# Altium schematic sheet PAGE1 - CONTENTS.SchDoc
size A3; DocumentNumber: 1; SheetNumber: 1; SheetTotal: 2
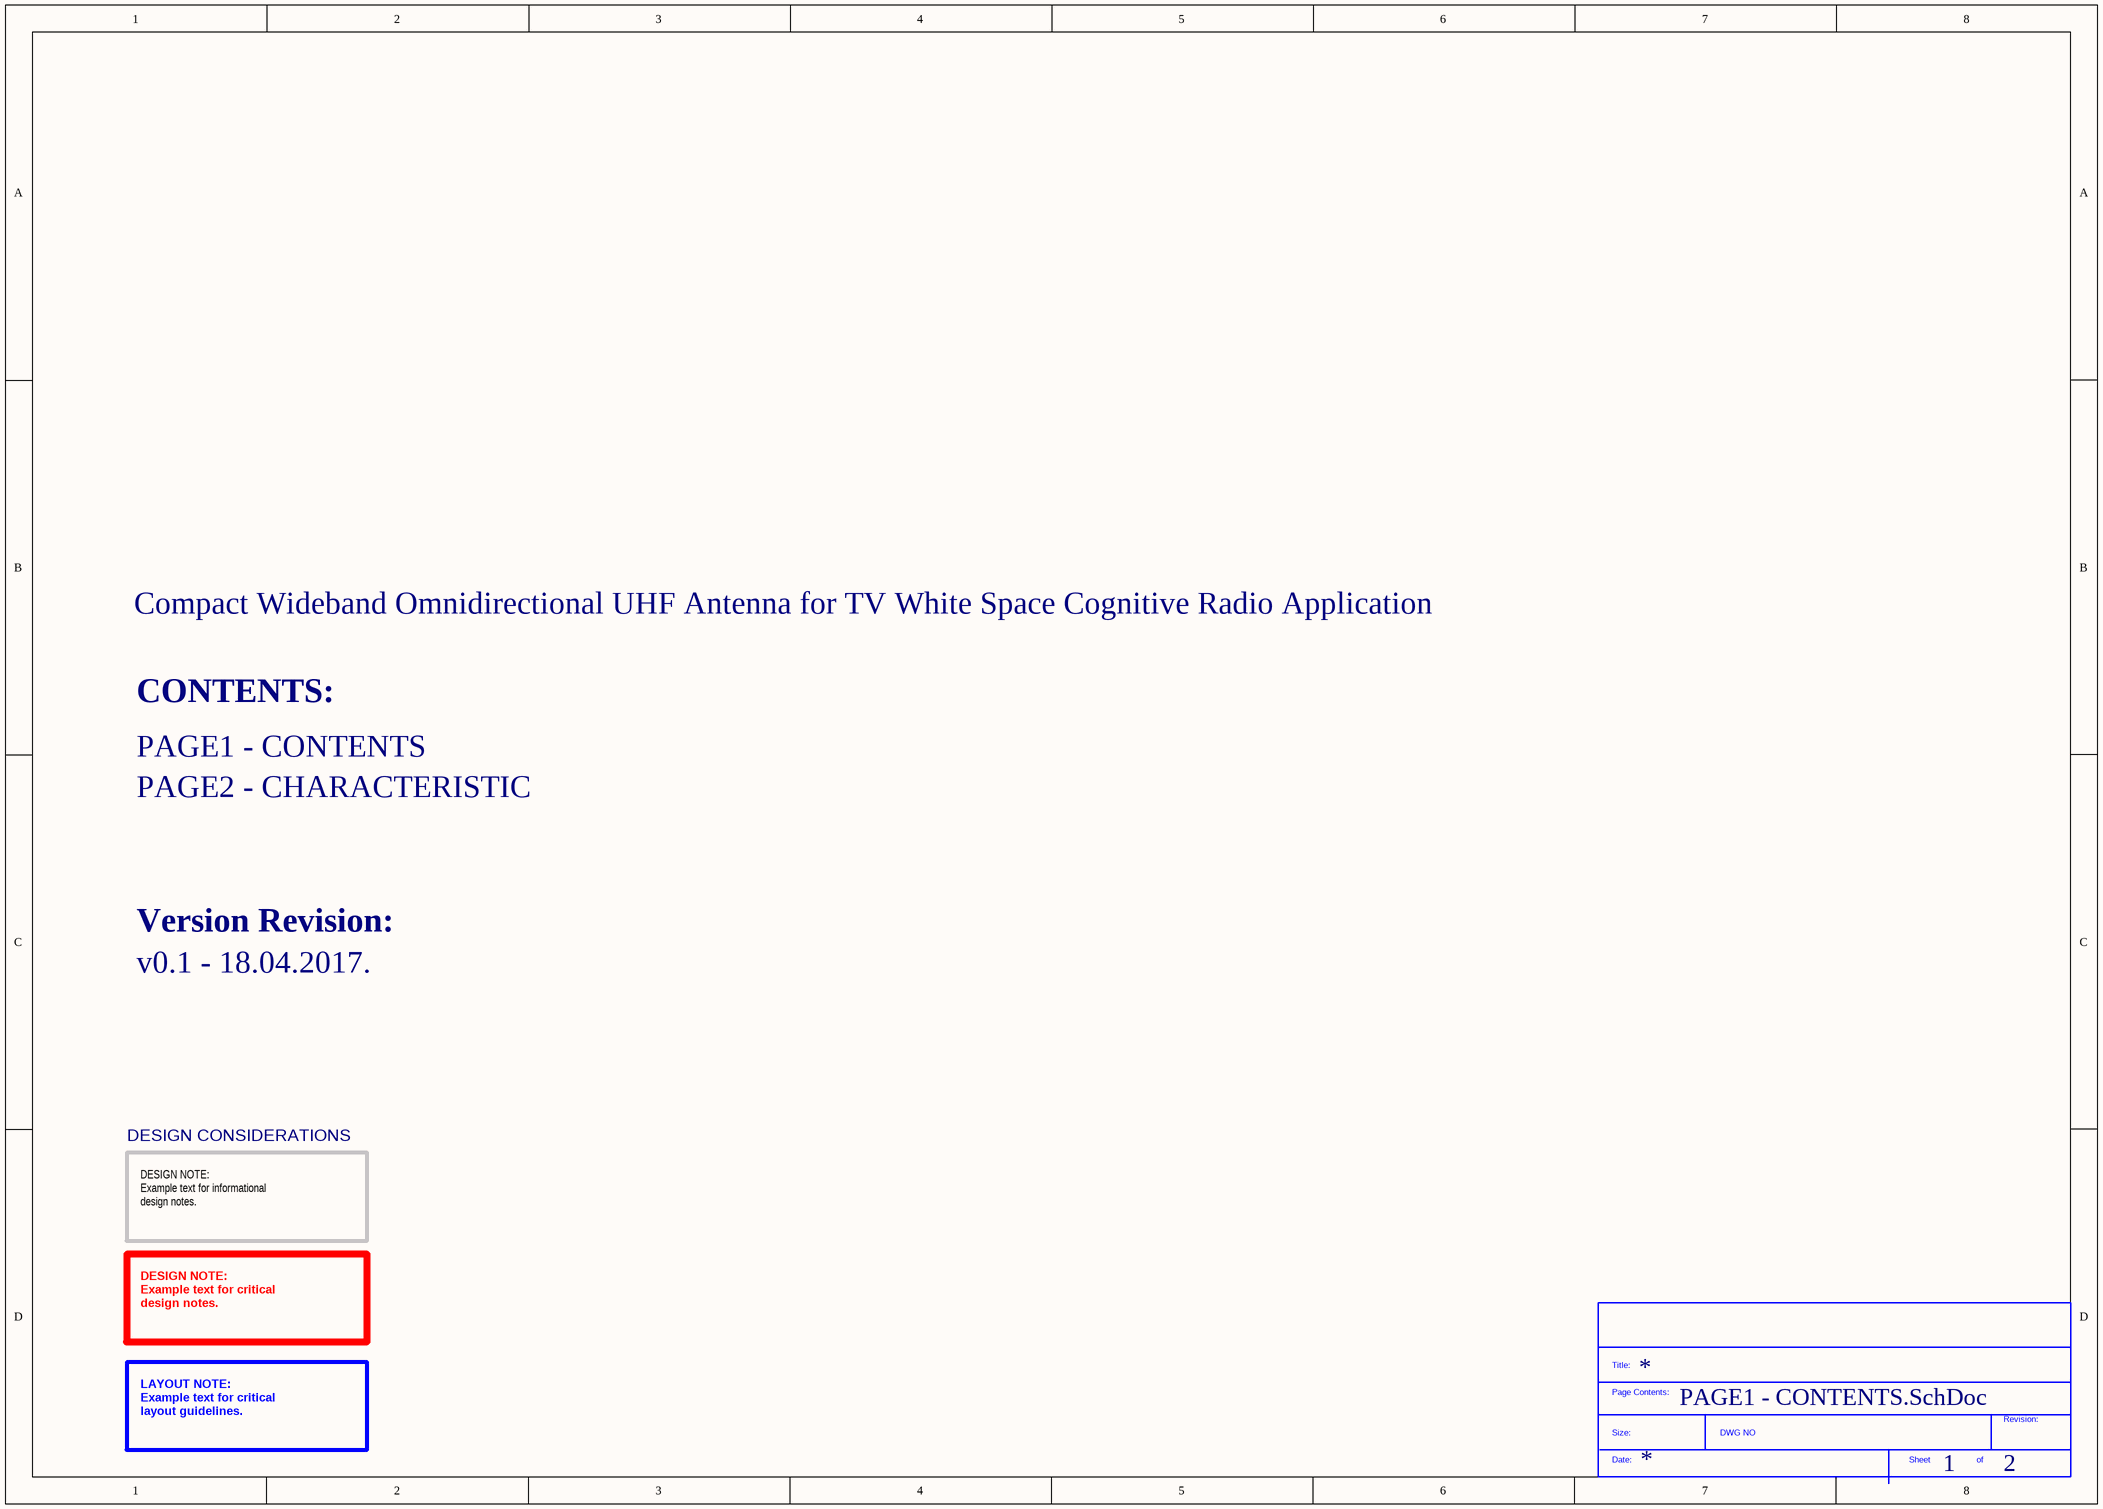
[diagram p0: PAGE1 - CONTENTS.SchDoc]

## Parts
*?  SDTitleBlock  (value not drawn)  (graphical)

## Notes on the sheet
- Compact Wideband Omnidirectional UHF Antenna for TV White Space Cognitive Radio Application
- CONTENTS:
- PAGE1 - CONTENTS
- PAGE2 - CHARACTERISTIC
- Version Revision:
- v0.1 - 18.04.2017.
- DESIGN CONSIDERATIONS
- DESIGN NOTE:
  Example text for informational
  design notes.
- DESIGN NOTE:
  Example text for critical
  design notes.
- LAYOUT NOTE:
  Example text for critical
  layout guidelines.
- (in symbol SDTitleBlock) Title:; Page Contents:; Revision:; Size:; DWG NO; Date:; Sheet; of